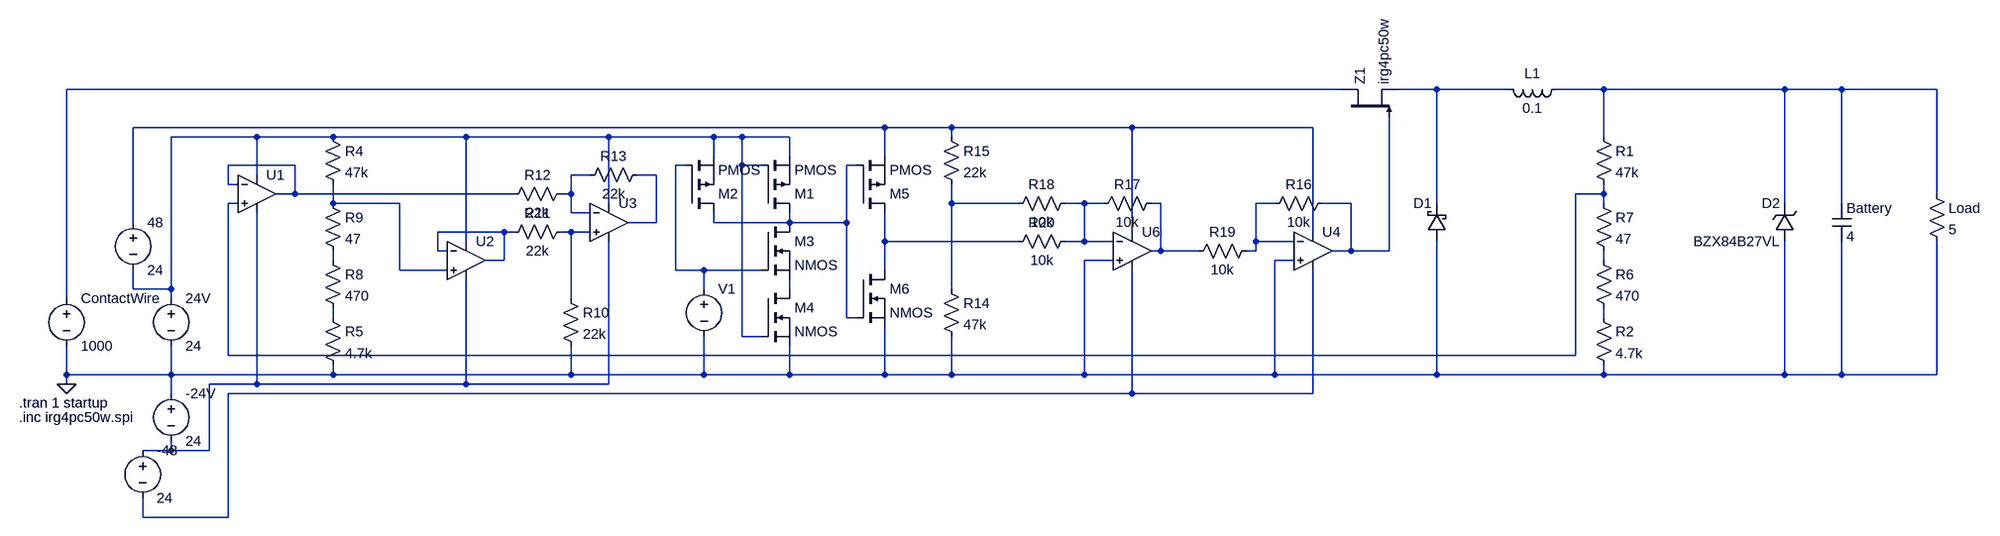
[diagram p0: schematic dc_dc_converter_reduced.asc]
dc_dc_converter_reduced.asc, the LTspice schematic file:
Version 4
SHEET 1 3904 680
WIRE 2816 -288 672 -288
WIRE 2976 -288 2912 -288
WIRE 3104 -288 2976 -288
WIRE 3264 -288 3184 -288
WIRE 3568 -288 3264 -288
WIRE 3664 -288 3568 -288
WIRE 3824 -288 3664 -288
WIRE 2048 -224 784 -224
WIRE 2160 -224 2048 -224
WIRE 2464 -224 2160 -224
WIRE 2768 -224 2464 -224
WIRE 992 -208 848 -208
WIRE 1120 -208 992 -208
WIRE 1344 -208 1120 -208
WIRE 1584 -208 1344 -208
WIRE 1760 -208 1584 -208
WIRE 1808 -208 1760 -208
WIRE 1888 -208 1808 -208
WIRE 2160 -208 2160 -224
WIRE 3264 -208 3264 -288
WIRE 1760 -176 1760 -208
WIRE 1888 -176 1888 -208
WIRE 2048 -176 2048 -224
WIRE 1056 -160 944 -160
WIRE 1712 -160 1696 -160
WIRE 1808 -160 1808 -208
WIRE 1840 -160 1808 -160
WIRE 2000 -160 1984 -160
WIRE 992 -144 992 -208
WIRE 1552 -144 1520 -144
WIRE 1664 -144 1632 -144
WIRE 944 -128 944 -160
WIRE 960 -128 944 -128
WIRE 1056 -112 1056 -160
WIRE 1056 -112 1024 -112
WIRE 1424 -112 1056 -112
WIRE 1520 -112 1520 -144
WIRE 1520 -112 1504 -112
WIRE 3264 -112 3264 -128
WIRE 3264 -112 3216 -112
WIRE 3824 -112 3824 -288
WIRE 960 -96 944 -96
WIRE 1120 -96 1120 -128
WIRE 1232 -96 1120 -96
WIRE 1584 -96 1584 -208
WIRE 2160 -96 2160 -128
WIRE 2272 -96 2160 -96
WIRE 2384 -96 2352 -96
WIRE 2416 -96 2384 -96
WIRE 2512 -96 2496 -96
WIRE 2704 -96 2672 -96
WIRE 2832 -96 2784 -96
WIRE 2976 -96 2976 -288
WIRE 3264 -96 3264 -112
WIRE 3568 -96 3568 -288
WIRE 3664 -96 3664 -288
WIRE 1520 -80 1520 -112
WIRE 1552 -80 1520 -80
WIRE 784 -64 784 -224
WIRE 1664 -64 1664 -144
WIRE 1664 -64 1616 -64
WIRE 1760 -64 1760 -80
WIRE 1888 -64 1888 -80
WIRE 1888 -64 1760 -64
WIRE 1984 -64 1984 -160
WIRE 1984 -64 1888 -64
WIRE 1408 -48 1296 -48
WIRE 1424 -48 1408 -48
WIRE 1520 -48 1504 -48
WIRE 1552 -48 1520 -48
WIRE 2464 -48 2464 -224
WIRE 2768 -48 2768 -224
WIRE 1344 -32 1344 -208
WIRE 2048 -32 2048 -80
WIRE 2272 -32 2048 -32
WIRE 2384 -32 2384 -96
WIRE 2384 -32 2352 -32
WIRE 2432 -32 2384 -32
WIRE 2672 -32 2672 -96
WIRE 2736 -32 2672 -32
WIRE 1296 -16 1296 -48
WIRE 1312 -16 1296 -16
WIRE 2512 -16 2512 -96
WIRE 2512 -16 2496 -16
WIRE 2576 -16 2512 -16
WIRE 2672 -16 2672 -32
WIRE 2672 -16 2656 -16
WIRE 2832 -16 2832 -96
WIRE 2832 -16 2800 -16
WIRE 2896 -16 2896 -240
WIRE 2896 -16 2832 -16
WIRE 1120 0 1120 -16
WIRE 1408 0 1408 -48
WIRE 1408 0 1376 0
WIRE 2432 0 2384 0
WIRE 2736 0 2704 0
WIRE 3264 0 3264 -16
WIRE 1232 16 1232 -96
WIRE 1312 16 1232 16
WIRE 1696 16 1696 -160
WIRE 1744 16 1696 16
WIRE 1840 16 1744 16
WIRE 2048 16 2048 -32
WIRE 784 48 784 16
WIRE 848 48 848 -208
WIRE 848 48 784 48
WIRE 1744 48 1744 16
WIRE 1888 48 1888 32
WIRE 2160 48 2160 -96
WIRE 672 64 672 -288
WIRE 848 64 848 48
WIRE 1520 64 1520 -48
WIRE 1120 96 1120 80
WIRE 1984 96 1984 -64
WIRE 2000 96 1984 96
WIRE 3264 96 3264 80
WIRE 1808 128 1808 -160
WIRE 1840 128 1808 128
WIRE 944 160 944 -96
WIRE 3216 160 3216 -112
WIRE 3216 160 944 160
WIRE 672 192 672 144
WIRE 848 192 848 144
WIRE 848 192 672 192
WIRE 1120 192 1120 176
WIRE 1120 192 848 192
WIRE 1520 192 1520 144
WIRE 1520 192 1120 192
WIRE 1744 192 1744 128
WIRE 1744 192 1520 192
WIRE 1888 192 1888 144
WIRE 1888 192 1744 192
WIRE 2048 192 2048 112
WIRE 2048 192 1888 192
WIRE 2160 192 2160 128
WIRE 2160 192 2048 192
WIRE 2384 192 2384 0
WIRE 2384 192 2160 192
WIRE 2704 192 2704 0
WIRE 2704 192 2384 192
WIRE 2976 192 2976 -32
WIRE 2976 192 2704 192
WIRE 3264 192 3264 176
WIRE 3264 192 2976 192
WIRE 3568 192 3568 -32
WIRE 3568 192 3264 192
WIRE 3664 192 3664 -32
WIRE 3664 192 3568 192
WIRE 3824 192 3824 -32
WIRE 3824 192 3664 192
WIRE 672 208 672 192
WIRE 992 208 992 -80
WIRE 992 208 912 208
WIRE 1344 208 1344 32
WIRE 1344 208 992 208
WIRE 1584 208 1584 -32
WIRE 1584 208 1344 208
WIRE 848 224 848 192
WIRE 2464 224 2464 16
WIRE 2464 224 944 224
WIRE 2768 224 2768 16
WIRE 2768 224 2464 224
WIRE 848 320 848 304
WIRE 848 320 800 320
WIRE 912 320 912 208
WIRE 912 320 848 320
WIRE 800 432 800 400
WIRE 944 432 944 224
WIRE 944 432 800 432
FLAG 672 208 0
SYMBOL voltage 672 48 R0
SYMATTR InstName ContactWire
SYMATTR Value 1000
SYMBOL Misc\\NIGBT 2816 -240 R270
SYMATTR InstName Z1
SYMATTR Value irg4pc50w
SYMATTR Prefix X
SYMBOL res 3248 -224 R0
SYMATTR InstName R1
SYMATTR Value 47k
SYMBOL res 3248 80 R0
SYMATTR InstName R2
SYMATTR Value 4.7k
SYMBOL cap 3648 -96 R0
SYMATTR InstName Battery
SYMATTR Value 4
SYMATTR SpiceLine Rser=25m IC=24
SYMBOL ind 3200 -304 R90
WINDOW 0 5 56 VBottom 2
WINDOW 3 32 56 VTop 2
SYMATTR InstName L1
SYMATTR Value 0.1
SYMBOL schottky 2992 -32 R180
WINDOW 0 24 64 Left 2
WINDOW 3 24 0 Invisible 2
SYMATTR InstName D1
SYMATTR Value RBR30T60A
SYMATTR Description Diode
SYMATTR Type diode
SYMBOL zener 3584 -32 R180
WINDOW 0 24 64 Left 2
WINDOW 3 24 0 Left 2
SYMATTR InstName D2
SYMATTR Value BZX84B27VL
SYMATTR Description Diode
SYMATTR Type diode
SYMBOL res 3808 -128 R0
SYMATTR InstName Load
SYMATTR Value 5
SYMBOL Opamps\\UniversalOpamp2 992 -112 R0
SYMATTR InstName U1
SYMBOL voltage 848 48 R0
SYMATTR InstName 24V
SYMATTR Value 24
SYMBOL res 1104 -224 R0
SYMATTR InstName R4
SYMATTR Value 47k
SYMBOL res 1104 80 R0
SYMATTR InstName R5
SYMATTR Value 4.7k
SYMBOL Opamps\\UniversalOpamp2 1344 0 R0
SYMATTR InstName U2
SYMBOL res 3248 -16 R0
SYMATTR InstName R6
SYMATTR Value 470
SYMBOL res 3248 -112 R0
SYMATTR InstName R7
SYMATTR Value 47
SYMBOL res 1104 -16 R0
SYMATTR InstName R8
SYMATTR Value 470
SYMBOL res 1104 -112 R0
SYMATTR InstName R9
SYMATTR Value 47
SYMBOL Opamps\\UniversalOpamp2 1584 -64 R0
SYMATTR InstName U3
SYMBOL res 1504 48 R0
SYMATTR InstName R10
SYMATTR Value 22k
SYMBOL res 1520 -64 R90
WINDOW 0 0 56 VBottom 2
WINDOW 3 32 56 VTop 2
SYMATTR InstName R11
SYMATTR Value 22k
SYMBOL res 1520 -128 R90
WINDOW 0 0 56 VBottom 2
WINDOW 3 32 56 VTop 2
SYMATTR InstName R12
SYMATTR Value 22k
SYMBOL res 1648 -160 R90
WINDOW 0 0 56 VBottom 2
WINDOW 3 32 56 VTop 2
SYMATTR InstName R13
SYMATTR Value 22k
SYMBOL voltage 848 208 R0
SYMATTR InstName -24V
SYMATTR Value 24
SYMBOL res 2144 32 R0
SYMATTR InstName R14
SYMATTR Value 47k
SYMBOL res 2144 -224 R0
SYMATTR InstName R15
SYMATTR Value 22k
SYMBOL voltage 784 -80 R0
SYMATTR InstName 48
SYMATTR Value 24
SYMBOL voltage 800 304 R0
SYMATTR InstName -48
SYMATTR Value 24
SYMBOL Opamps\\UniversalOpamp2 2464 -16 R0
SYMATTR InstName U6
SYMBOL res 2512 -112 R90
WINDOW 0 0 56 VBottom 2
WINDOW 3 32 56 VTop 2
SYMATTR InstName R17
SYMATTR Value 10k
SYMBOL res 2368 -112 R90
WINDOW 0 0 56 VBottom 2
WINDOW 3 32 56 VTop 2
SYMATTR InstName R18
SYMATTR Value 10k
SYMBOL res 2368 -48 R90
WINDOW 0 0 56 VBottom 2
WINDOW 3 32 56 VTop 2
SYMATTR InstName R20
SYMATTR Value 10k
SYMBOL voltage 1744 32 R0
WINDOW 3 24 96 Invisible 2
WINDOW 123 0 0 Left 0
WINDOW 39 0 0 Left 0
SYMATTR InstName V1
SYMATTR Value PULSE(0 24 0.1 1u 1u 1000u 2000u)
SYMBOL pmos 1840 -80 M180
SYMATTR InstName M1
SYMBOL pmos 1712 -80 M180
SYMATTR InstName M2
SYMBOL nmos 1840 -64 R0
SYMATTR InstName M3
SYMBOL nmos 1840 48 R0
SYMATTR InstName M4
SYMBOL Opamps\\UniversalOpamp2 2768 -16 R0
SYMATTR InstName U4
SYMBOL res 2800 -112 R90
WINDOW 0 0 56 VBottom 2
WINDOW 3 32 56 VTop 2
SYMATTR InstName R16
SYMATTR Value 10k
SYMBOL res 2672 -32 R90
WINDOW 0 0 56 VBottom 2
WINDOW 3 32 56 VTop 2
SYMATTR InstName R19
SYMATTR Value 10k
SYMBOL pmos 2000 -80 M180
SYMATTR InstName M5
SYMBOL nmos 2000 16 R0
SYMATTR InstName M6
TEXT 592 240 Left 2 !.tran 1 startup
TEXT 592 264 Left 2 !.inc irg4pc50w.spi

The netlist it stands for:
* dc_dc_converter_reduced.asc
V§ContactWire N001 0 1000
XZ1 N001 N017 N002 irg4pc50w  ; pins C G E
R1 N003 N011 47k
R2 N025 0 4.7k
C§Battery N003 0 4 Rser=25m IC=24
L1 N003 N002 0.1
D1 0 N002 RBR30T60A
D2 0 N003 BZX84B27VL
R§Load N003 0 5
XU1 N011 N006 N005 N026 N006 level.2 Avol=1Meg GBW=10Meg Slew=10Meg ilimit=25m rail=0 Vos=0 phimargin=45 en=0 enk=0 in=0 ink=0 Rin=500Meg  ; pins IN+ IN- V+ V- OUT
V§24V N005 0 24
R4 N005 N012 47k
R5 N024 0 4.7k
XU2 N012 N018 N005 N026 N018 level.2 Avol=1Meg GBW=10Meg Slew=10Meg ilimit=25m rail=0 Vos=0 phimargin=45 en=0 enk=0 in=0 ink=0 Rin=500Meg  ; pins IN+ IN- V+ V- OUT
R6 N022 N025 470
R7 N011 N022 47
R8 N021 N024 470
R9 N012 N021 47
XU3 N019 N009 N005 N026 N010 level.2 Avol=1Meg GBW=10Meg Slew=10Meg ilimit=25m rail=0 Vos=0 phimargin=45 en=0 enk=0 in=0 ink=0 Rin=500Meg  ; pins IN+ IN- V+ V- OUT
R10 N019 0 22k
R11 N019 N018 22k
R12 N009 N006 22k
R13 N010 N009 22k
V§-24V 0 N026 24
R14 N013 0 47k
R15 N004 N013 22k
V§48 N004 N005 24
V§-48 N026 N027 24
XU6 0 N014 N004 N027 N015 level.2 Avol=1Meg GBW=10Meg Slew=10Meg ilimit=25m rail=0 Vos=0 phimargin=45 en=0 enk=0 in=0 ink=0 Rin=500Meg  ; pins IN+ IN- V+ V- OUT
R17 N015 N014 10k
R18 N014 N013 10k
R20 N014 N020 10k
V1 N007 0 PULSE(0 24 0.1 1u 1u 1000u 2000u)
M1 N008 N005 N005 N005 PMOS
M2 N008 N007 N005 N005 PMOS
M3 N008 N007 N023 N023 NMOS
M4 N023 N005 0 0 NMOS
XU4 0 N016 N004 N027 N017 level.2 Avol=1Meg GBW=10Meg Slew=10Meg ilimit=25m rail=0 Vos=0 phimargin=45 en=0 enk=0 in=0 ink=0 Rin=500Meg  ; pins IN+ IN- V+ V- OUT
R16 N017 N016 10k
R19 N016 N015 10k
M5 N020 N008 N004 N004 PMOS
M6 N020 N008 0 0 NMOS
.model D D
.lib standard.dio
.model NMOS NMOS
.model PMOS PMOS
.lib standard.mos
.tran 1 startup
.inc irg4pc50w.spi
.lib UniversalOpamps2.sub
.backanno
.end